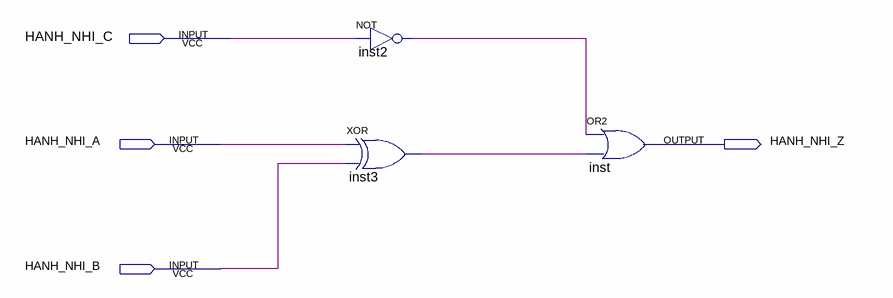
[diagram p0: schematic sheet]
// Quartus schematic Assignment4.bdf as structural Verilog: 3 symbols, 4 pins
module Assignment4 (
  input  HANH_NHI_C,
  input  HANH_NHI_A,
  input  HANH_NHI_B,
  output HANH_NHI_Z
);

  wire inst2_out, inst3_out;

  not inst2 (inst2_out, HANH_NHI_C);
  xor inst3 (inst3_out, HANH_NHI_A, HANH_NHI_B);
  or inst (HANH_NHI_Z, inst2_out, inst3_out);
endmodule
